# Altium schematic sheet 98 - MECH.SchDoc
size A4; DocumentNumber: 2; SheetNumber: 2; SheetTotal: 3; SchemaTitle: Title?
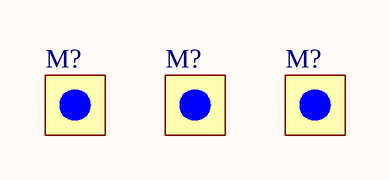
[diagram p0: 98 - MECH.SchDoc]

## Parts
(Parts that share a designator on the sheet are numbered #1, #2 ... from top to bottom, then left to right.)
M?#1  Fiducial Round  [Fiducial round_small]  (value not drawn)  (no BOM)
M?#2  Fiducial Round  [Fiducial round_small]  (value not drawn)  (no BOM)
M?#3  Fiducial Round  [Fiducial round_small]  (value not drawn)  (no BOM)

## Notes on the sheet
- THIS DOCUMENT AND THE DATA DISCLOSED HEREIN OR
- HEREWITH IS THE PROPERTY OF ALTIUM LIMITED AND MAY
- DWG NO:
- REVISION
- REV:
- DESCRIPTION
- DATE
- APPROVED
- BE FREELY DISTRIBUTED IN WHOLE. NO RIGHTS ARE
- RESERVED OR EXPRESS OR IMPLIED WARANTEE GIVEN.
- ENG:
- APPROVALS
- PROJECT
- DSN:
- CHK:
- REFERENCE DOCUMENTS
- PROJECT REVISION:
- TITLE
- DOCUMENT REVISION:
- DESIGN ITEM:
- BOM:
- FAB DWG:
- PCB DWG:
- ASSY DWG:
- SCALE:
- A3
- SIZE
- CAGE CODE
- FILE NAME
- DWG NO.
- SHEET
- OF
- REV

## Library data of the parts
M?#1-M?#3 = Fiducial Round-10: Fiducial (Optical Marker)